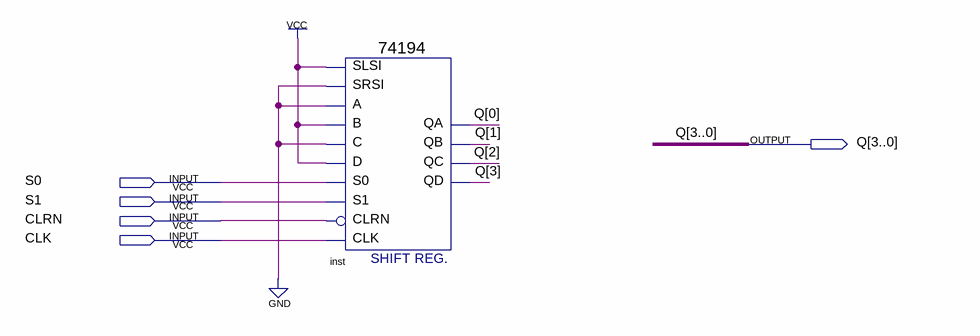
[diagram p0: schematic sheet]
// Quartus schematic lab1.bdf as structural Verilog: 1 symbols, 5 pins
module lab1 (
  input  S0,
  input  S1,
  input  CLRN,
  input  CLK,
  output [3:0] Q
);

  \74194  inst (
    .SLSI(1'b1), .SRSI(1'b0), .B(1'b1), .C(1'b0), .CLK(CLK), .CLRN(CLRN), .D(1'b1), .S1(S1), .S0(S0),
    .A(1'b0), .QA(Q[0]), .QB(Q[1]), .QC(Q[2]), .QD(Q[3]));
endmodule
